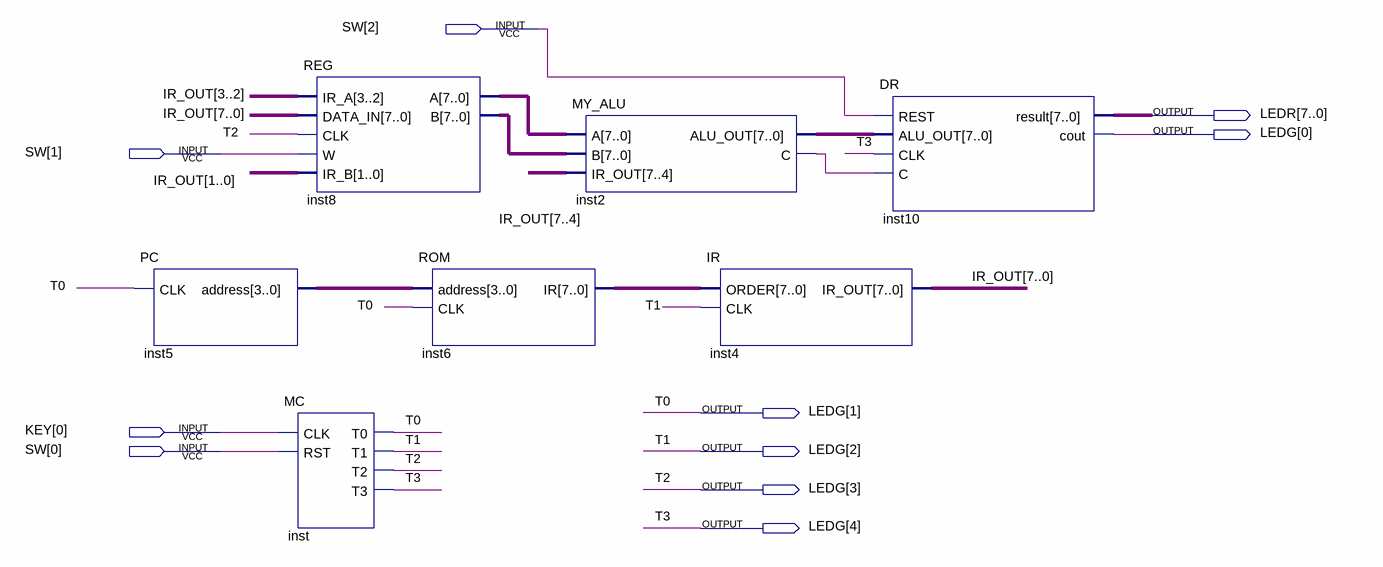
[diagram p0: schematic sheet]
// Quartus schematic CPU.bdf as structural Verilog: 7 symbols, 10 pins
module CPU (
  input  [2:0] SW,
  input  [0:0] KEY,
  output [7:0] LEDR,
  output [4:0] LEDG
);

  wire inst2_c;
  wire [3:0] inst5_address;
  wire [7:0] inst2_alu_out, inst6_ir, inst8_a, inst8_b, IR_OUT;

  PC inst5 (.CLK(LEDG[1]), .address(inst5_address));
  REG inst8 (
    .IR_A(IR_OUT[3:2]), .DATA_IN(IR_OUT), .CLK(LEDG[3]), .W(SW[1]), .IR_B(IR_OUT[1:0]), .A(inst8_a),
    .B(inst8_b));
  MC inst (.CLK(KEY[0]), .RST(SW[0]), .T0(LEDG[1]), .T1(LEDG[2]), .T2(LEDG[3]), .T3(LEDG[4]));
  ROM inst6 (.address(inst5_address), .CLK(LEDG[1]), .IR(inst6_ir));
  MY_ALU inst2 (.A(inst8_a), .B(inst8_b), .IR_OUT(IR_OUT[7:4]), .ALU_OUT(inst2_alu_out), .C(inst2_c));
  IR inst4 (.ORDER(inst6_ir), .CLK(LEDG[2]), .IR_OUT(IR_OUT));
  DR inst10 (.REST(SW[2]), .ALU_OUT(inst2_alu_out), .CLK(LEDG[4]), .C(inst2_c), .result(LEDR), .cout(LEDG[0]));

  // Other names for the same wires on the sheet: T0 = LEDG[1]; T1 = LEDG[2]; T2 = LEDG[3]; T3 = LEDG[4]
endmodule
